# EAGLE design Mainsnode (EAGLE 6.2)
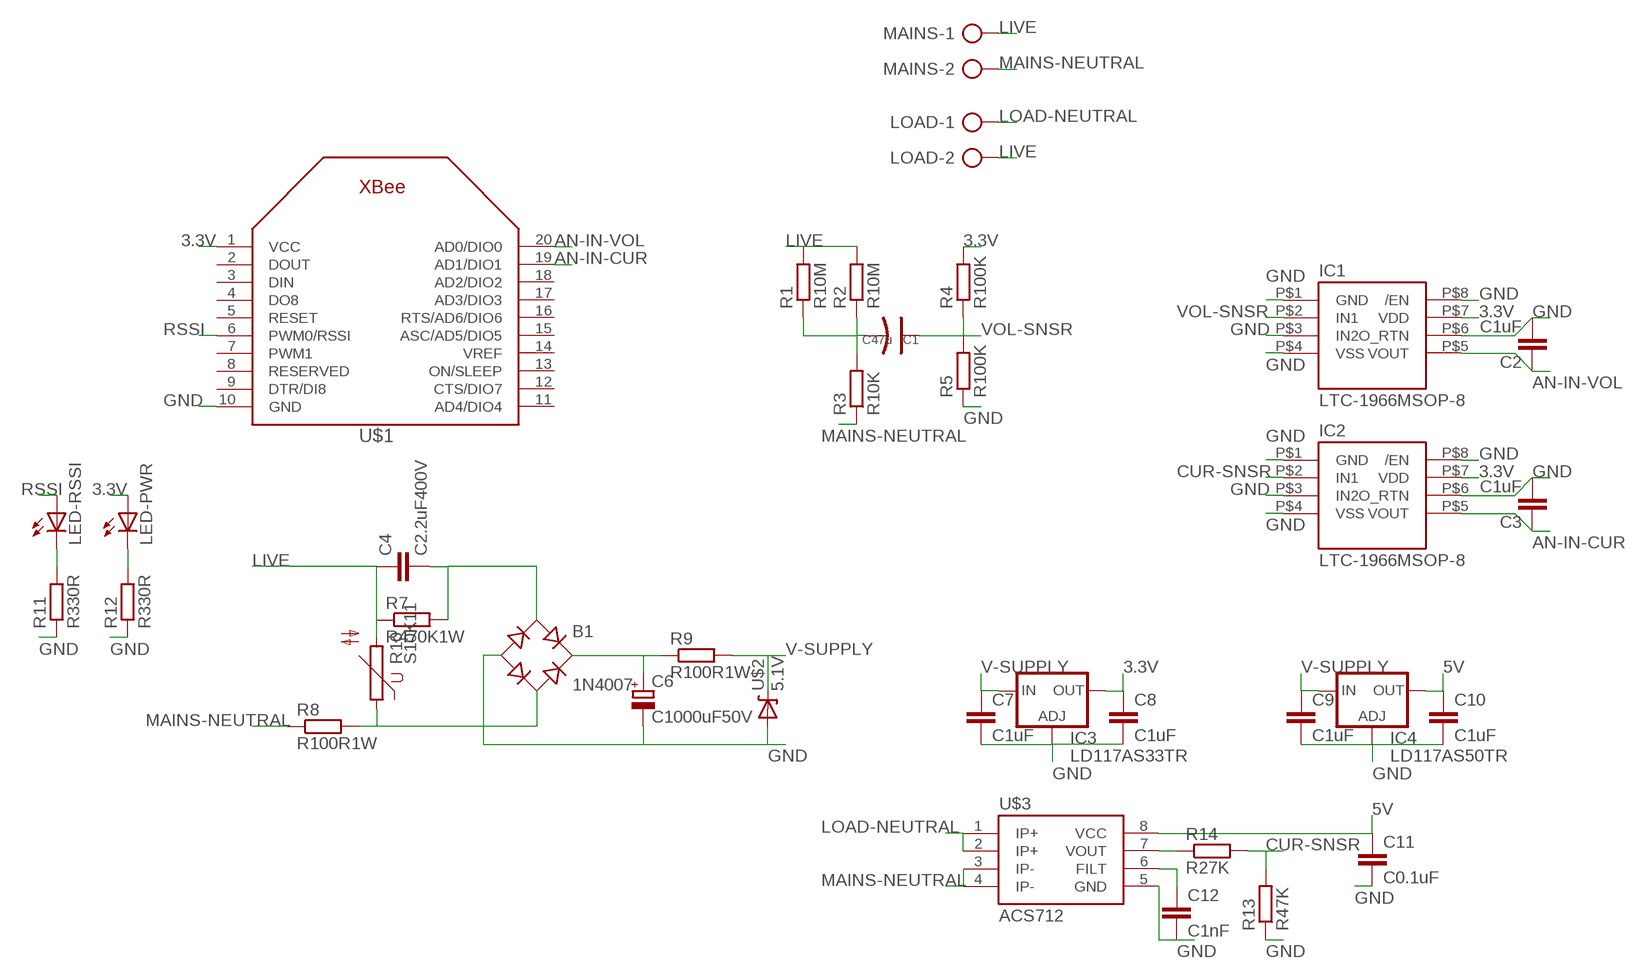
[diagram p0: schematic, sheet 1]

## Parts
B1  1N4007  RB1A  [RB1A]
C1  C47u  C-POLAR-C  [AVX-C]
C2  C1uF  C-EUC0805  [C0805]
C3  C1uF  C-EUC0805  [C0805]
C4  C2.2uF400V  C-EU150-064X183  [C150-064X183]
C6  C1000uF50V  CPOL-EUE2-5  [E2-5]
C7  C1uF  C-EUC0805  [C0805]
C8  C1uF  C-EUC0805  [C0805]
C9  C1uF  C-EUC0805  [C0805]
C10  C1uF  C-EUC0805  [C0805]
C11  C0.1uF  C-EUC0805  [C0805]
C12  C1nF  C-EUC0805  [C0805]
IC1  LTC-1966MSOP-8  [MSOP-8]
IC2  LTC-1966MSOP-8  [MSOP-8]
IC3  LD117AS33TR  [SOT223]
IC4  LD117AS50TR  [SOT223]
LED-PWR  LED0603  [LED-0603]
LED-RSSI  LED0603  [LED-0603]
LOAD  AK300/2  [AK300/2]
MAINS  AK300/2  [AK300/2]
R1  R10M  R-EU_0309/V  [0309V]
R2  R10M  R-EU_R0603  [R0603]
R3  R10K  R-EU_R0603  [R0603]
R4  R100K  R-EU_R0603  [R0603]
R5  R100K  R-EU_R0603  [R0603]
R7  R470K1W  R-EU_0309/V  [0309V]
R8  R100R1W  R-EU_0309/V  [0309V]
R9  R100R1W  R-EU_0309/V  [0309V]
R10  S10K11  [S10K11]
R11  R330R  R-EU_R0603  [R0603]
R12  R330R  R-EU_R0603  [R0603]
R13  R47K  R-EU_R0603  [R0603]
R14  R27K  R-EU_R0603  [R0603]
U$1  XBEE  [XBEE]
U$2  5.1V  DIODE-ZENERPTH  [DIODE-ZENER]
U$3  ACS712  [SO08]

## Nets
3.3V: C8.1 IC1.P$7(VDD) IC2.P$7(VDD) IC3.4(OUT) LED-PWR.A R4.2 U$1.1(VCC)
5V: C10.1 C11.1 IC4.4(OUT) U$3.8(VCC)
AN-IN-CUR: C3.1 IC2.P$5(VOUT) U$1.19(AD1/DIO1)
AN-IN-VOL: C2.1 IC1.P$5(VOUT) U$1.20(AD0/DIO0)
CUR-SNSR: IC2.P$2(IN1) R13.2 R14.2
GND: B1.- C2.2 C3.2 C6.- C7.2 C8.2 C9.2 C10.2 C11.2 C12.2 IC1.P$1(GND) IC1.P$3(IN2) IC1.P$4(VSS) IC1.P$6(O_RTN) IC1.P$8(/EN) IC2.P$1(GND) IC2.P$3(IN2) IC2.P$4(VSS) IC2.P$6(O_RTN) IC2.P$8(/EN) IC3.1(ADJ) IC4.1(ADJ) R5.1 R11.1 R12.1 R13.1 U$1.10(GND) U$2.P$2(A) U$3.5(GND)
LIVE: C4.1 LOAD.2 MAINS.1 R1.2 R2.2 R7.1 R10.2
LOAD-NEUTRAL: LOAD.1 U$3.1(IP+) U$3.2(IP+)
MAINS-NEUTRAL: MAINS.2 R3.1 R8.1 U$3.3(IP-) U$3.4(IP-)
N$1: C1.- R1.1 R2.1 R3.2
N$3: B1.+ C6.+ R9.1
N$4: LED-RSSI.C R11.2
N$5: B1.AC1 C4.2 R7.2
N$6: B1.AC2 R8.2 R10.1
N$7: C12.1 U$3.6(FILT)
N$8: LED-PWR.C R12.2
N$9: R14.1 U$3.7(VOUT)
RSSI: LED-RSSI.A U$1.6(PWM0/RSSI)
V-SUPPLY: C7.1 C9.1 IC3.3(IN) IC4.3(IN) R9.2 U$2.P$1(C)
VOL-SNSR: C1.+ IC1.P$2(IN1) R4.1 R5.2
Unconnected: U$1.2(DOUT) U$1.3(DIN) U$1.4(DO8) U$1.5(RESET) U$1.7(PWM1) U$1.8(RESERVED) U$1.9(DTR/DI8) U$1.11(AD4/DIO4) U$1.12(CTS/DIO7) U$1.13(ON/SLEEP) U$1.14(VREF) U$1.15(ASC/AD5/DIO5) U$1.16(RTS/AD6/DIO6) U$1.17(AD3/DIO3) U$1.18(AD2/DIO2)

## Library data of the parts
B1 = rectifier:RB1A: RECTIFIER 1 A
C1 = OPL Eagle Library:C-POLAR*
C2-C4 C7-C12 = resistor:C-EU: CAPACITOR, European symbol
C6 = resistor:CPOL-EU: POLARIZED CAPACITOR, European symbol
IC1 IC2 = custom-tigor:LTC-1966
IC3 IC4 = v-reg:LD117A?*: Low drop fixed and adjustable positive voltage regulators 1 A Source: http://www.st.com/stonline/products/literature/ds/7194/ld1117axx.pdf
LED-PWR LED-RSSI = SparkFun-LED:LED: LEDs Standard schematic elements and footprints for 5mm, 3mm, 1206, and 0603 sized LEDs. 5mm - Spark Fun Electronics SKU : COM-00529 (and others)
LOAD MAINS = con-ptr500:AK300/2: CONNECTOR; OC_FARNELL: unknown; OC_NEWARK: unknown
R1-R5 R7-R9 R11-R14 = resistor:R-EU_: RESISTOR, European symbol
R10 = varistor:S10K11: VARISTOR
U$1 = adafruit:XBEE
U$2 = SparkFun-DiscreteSemi:DIODE-ZENER: Zener Diode Production Part - 8199 3.4V Zener Voltage
U$3 = SparkFun-AnalogIC:ACS712: Hall-effect-based isolated linear current sensor

## Board
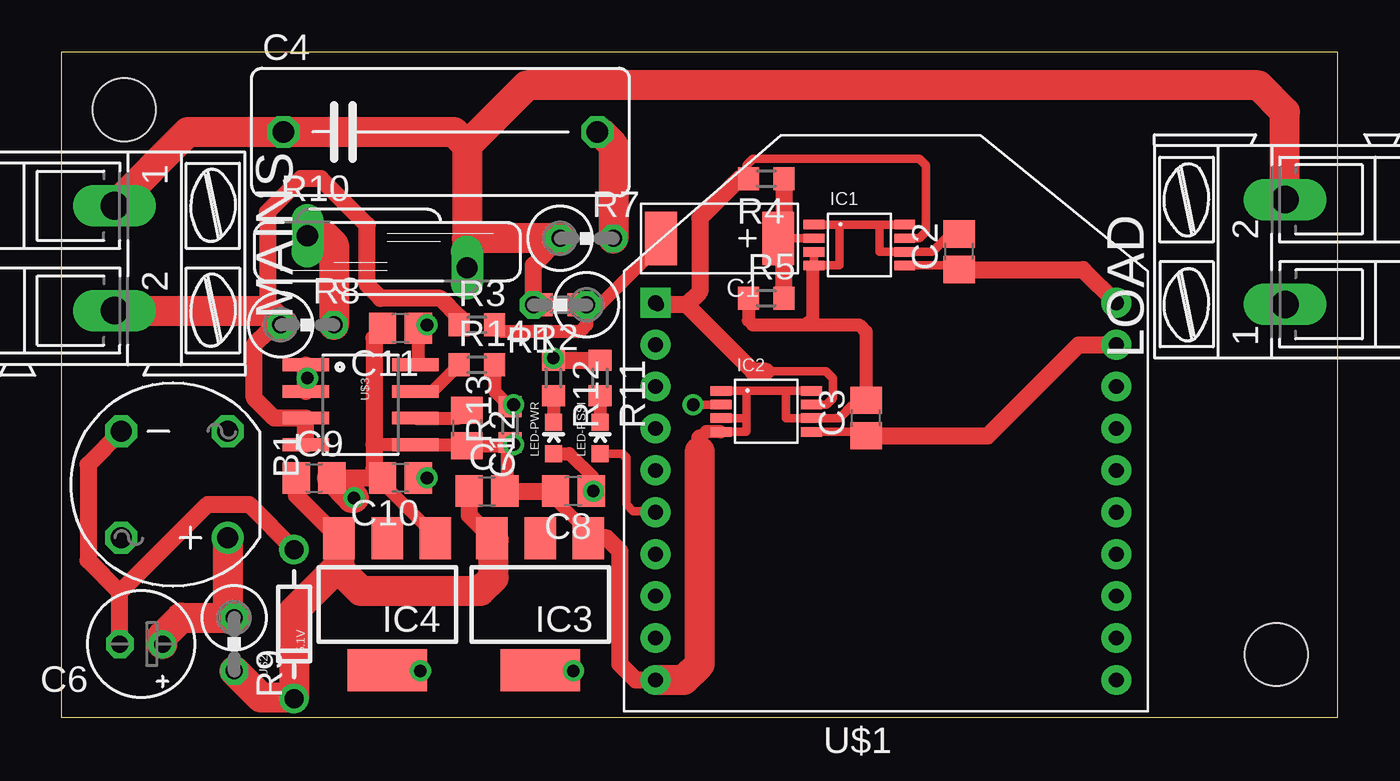
[diagram p1: board, top side]
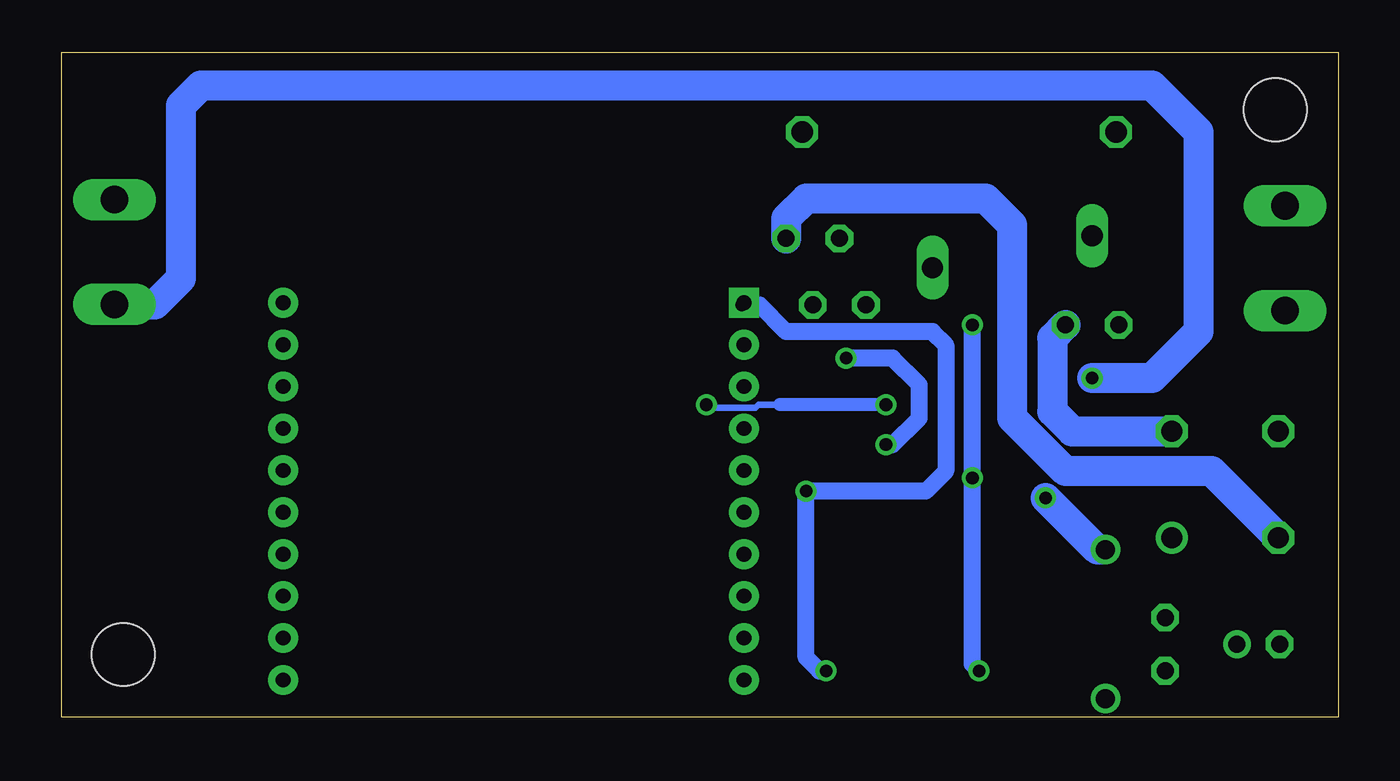
[diagram p2: board, bottom side, seen from below]

Size 60.95 x 31.74 mm. Coordinates in mm from the lower left corner, seen from the top.
Outline: 0,0 60.95,0 60.95,31.74 0,31.74 0,0
Copper layers (1*16): Top 0.035mm / dielectric 1.5mm / Bottom 0.035mm
Design rules: minimum track width 10mil, minimum drill 24mil, track to track 8mil, track to pad 8mil, pad to pad 8mil, via to via 8mil, smd to smd 8mil, copper to edge 40mil, drill to drill 8mil, minimum pad ring 10mil, minimum via ring 8mil, stop-mask expansion 4mil, vias tented up to drill 0mil, thermal gap 10mil
Holes 3 mm at 3,29 58,3

### Footprints (pad centres in the part's own frame; a part is rotated, then mirrored left to right if it is on the bottom)
RB1A = drill 1.016: + -2.54,2.54 | drill 1.016 octagon: - 2.54,-2.54; AC1 2.54,2.54; AC2 -2.54,-2.54
AVX-C = smd 1.524 x 2.54: + -2.794,0; - 2.794,0
C0805 = smd 1.3 x 1.5: 1 -0.85,0; 2 0.85,0
C150-064X183 = drill 1.016 octagon: 1 -7.493,0; 2 7.493,0
E2-5 = drill 0.813 pad 1.27: + -1.016,0 | drill 0.813 pad 1.27 octagon: - 1.016,0
MSOP-8 = smd 0.45 x 1: P$1 -0.975,-2.165; P$2 -0.325,-2.165; P$3 0.325,-2.165; P$4 0.975,-2.165; P$5 0.975,2.165; P$6 0.325,2.165; P$7 -0.325,2.165; P$8 -0.975,2.165
SOT223 = smd 1.5 x 2: 1 -2.3,-3.15; 2 0,-3.15; 3 2.3,-3.15 | smd 3.8 x 2: 4 0,3.15
LED-0603 = smd 0.8 x 0.8: A 0,-0.75; C 0,0.75
AK300/2 = drill 1.321 long: 1 -2.515,0; 2 2.489,0
0309V = drill 0.813 octagon: 1 -1.27,0; 2 1.27,0
R0603 = smd 1 x 1.1: 1 -0.85,0; 2 0.85,0
S10K11 = drill 1.016 long: 1 -0.762,-3.81; 2 0.762,3.81
XBEE = drill 0.7 pad 1.422 square: 1 -11,5.5 | drill 0.7 pad 1.422: 2 -11,3.5; 3 -11,1.5; 4 -11,-0.5; 5 -11,-2.5; 6 -11,-4.5; 7 -11,-6.5; 8 -11,-8.5; 9 -11,-10.5; 10 -11,-12.5; 11 11,-12.5; 12 11,-10.5; 13 11,-8.5; 14 11,-6.5; 15 11,-4.5; 16 11,-2.5; 17 11,-0.5; 18 11,1.5; 19 11,3.5; 20 11,5.5
DIODE-ZENER = drill 0.9: P$1 -3.556,0; P$2 3.556,0
SO08 = smd 0.61 x 2.21: 1 -1.905,-2.616; 2 -0.635,-2.616; 3 0.635,-2.616; 4 1.905,-2.616; 5 1.905,2.616; 6 0.635,2.616; 7 -0.635,2.616; 8 -1.905,2.616

### Placement (x,y rotation side)
B1  5.4,11.11 180 top
C1  31.43,22.86 180 top
C2  42.86,22.23 90 top
C3  38.42,14.29 90 top
C4  18.1,27.94 0 top
C6  3.81,3.49 180 top
C7  20.32,10.79 0 top
C8  24.45,10.79 180 top
C9  12.06,11.43 0 top
C10  16.19,11.43 180 top
C11  16.19,18.57 180 top
C12  19.37,13.81 270 top
IC1  38.1,22.54 270 top
IC2  33.66,14.61 270 top
IC3  22.86,5.4 180 top
IC4  15.56,5.4 180 top
LED-PWR  23.5,13.34 0 top
LED-RSSI  25.72,13.34 0 top
LOAD  58.42,22.23 90 top
MAINS  2.54,21.91 270 top
R1  23.81,19.68 180 top
R2  23.81,19.68 180 top
R3  19.84,18.73 0 top
R4  33.66,25.72 180 top
R5  33.66,20 0 top
R7  25.08,22.86 0 top
R8  11.75,18.73 0 top
R9  8.26,3.49 270 top
R10  15.56,22.23 270 top
R11  25.72,16.19 270 top
R12  23.5,16.19 270 top
R13  21.43,13.97 90 top
R14  19.84,16.83 0 top
U$1  39.37,14.29 0 top
U$2  11.11,4.45 90 top
U$3  14.29,14.92 270 top

### Tracks (layer width: path | path; a pad name or v marks a point on that pad's centre or on a via)
3.3V  (via drill 0.6)
  Top 0.406: IC1.P$7 40.97,22.87 41.27,23.18 41.27,26.35 40.96,26.67 33.02,26.67 32.7,26.35 32.7,25.82 R4.2 | IC2.P$7 36.52,14.93 36.83,15.24 36.83,16.19 36.51,16.51 33.66,16.51
  Top 0.61: LED-PWR.A 24.25,12.59 25.4,11.43 25.4,10.9 C8.1
  Top 0.813: R4.2 32.38,25.72 30.48,23.81 30.48,20.32 29.84,19.68 | 29.84,19.68 v28.47,19.68 U$1.1 | 33.66,16.51 33.02,16.51 29.84,19.68 | v24.45,2.22 22.89,2.22 IC3.4 | 25.4,10.9 v25.4,10.79
  Bottom 0.813: v24.45,2.22 24.77,2.22 25.4,2.86 v25.4,10.79 19.68,10.79 18.73,11.75 18.73,17.78 19.37,18.41 26.35,18.41 27.62,19.68 v28.47,19.68
5V  (via drill 0.6)
  Top 0.61: C11.1 17.04,16.97 U$3.8
  Top 0.813: v17.14,2.22 15.58,2.22 IC4.4 | v17.46,11.43 C10.1 | v17.46,18.73 17.2,18.73 C11.1
  Bottom 0.813: v17.14,2.22 17.46,2.54 v17.46,11.43 v17.46,18.73
AN-IN-CUR
  Top 0.406: IC2.P$5 38.23,13.63 C3.1
  Top 0.813: C3.1 44.23,13.44 48.58,17.78 U$1.19
AN-IN-VOL
  Top 0.406: IC1.P$5 42.67,21.57 C2.1
  Top 0.813: C2.1 48.78,21.38 U$1.20
CUR-SNSR  (via drill 0.6)
  Top 0.406: IC2.P$2 v30.17,14.93 v30.16,14.92
  Top 0.61: R14.2 20.69,15.56 R13.2 21.49,14.82 v21.59,14.92
  Bottom 0.305: 26.67,14.92 27.68,14.92 27.8,14.8 27.81,14.79 30.02,14.79 v30.16,14.92
  Bottom 0.61: v21.59,14.92 26.67,14.92
GND  (via drill 0.6)
  Top 0.406: C3.2 38.2,14.92 37.78,14.92 37.14,14.28 IC2.P$6 34.62,14.28 34.61,14.29 34.61,15.58 | IC2.P$8 34.61,15.58 | 34.61,15.58 32.7,15.58 | 32.7,15.58 IC2.P$1 | IC2.P$3 32.38,14.28 32.38,14.29 32.7,14.29 | 32.7,14.29 32.7,15.58 | IC2.P$4 32.68,13.63 32.7,13.65 32.7,14.29 | IC1.P$3 IC1.P$4 35.96,21.59 37.15,21.59 37.15,23.5 | IC1.P$1 37.12,23.52 37.15,23.5 | IC1.P$8 39.05,23.52 | 39.05,23.52 37.17,23.52 37.15,23.5 | 39.05,23.52 39.05,22.23 39.06,22.22 IC1.P$6 41.59,22.23 42.44,23.07 C2.2
  Top 0.61: 21.27,12.96 C12.2 19.31,13.02 U$3.5 14.92,13.02 | 21.27,12.96 R13.1 | R5.1 32.8,18.95 33.02,18.73 35.56,18.73 | 35.56,18.73 35.88,19.05 35.88,21.51 IC1.P$4 | C10.2 15.34,11.17 17.46,9.05 17.46,8.94 IC4.1 | C8.2 23.6,10.38 24.77,9.21 24.77,8.94 IC3.1 | 21.27,12.96 21.27,10.9 C7.2 | 30.48,13.34 30.8,13.65 31.47,13.65 IC2.P$4 | 35.56,18.73 38.1,18.73 38.42,18.41 C3.2
  Top 0.813: R11.1 R12.1 v23.5,17.14 | C6.- 2.79,5.97 | 2.79,5.97 6.99,10.16 8.95,10.16 U$2.P$2 | B1.- 1.27,12.06 1.27,7.49 2.79,5.97 | C9.2 C10.2 14.92,11.85 14.92,13.02 14.92,18.1 15.34,18.52 C11.2 | C7.2 C8.2 | IC3.1 25.18,8.57 26.04,8.57 26.67,7.94 26.67,2.54 27.42,1.79 U$1.10 | v21.59,13.02 21.53,13.02 R13.1 | 30.48,12.7 30.48,13.34
  Top 1.422: U$1.10 29.73,1.79 30.48,2.54 30.48,12.7 | v13.97,10.48 13.87,10.48 C9.2
  Bottom 0.813: v21.59,13.02 21.27,13.02 20,14.29 20,15.88 21.27,17.14 v23.5,17.14
  Bottom 1.422: U$2.P$2 11.49,8 v13.97,10.48
LIVE
  Top 0.813: R7.1 22.54,21.59 R1.2 R2.2
  Top 1.422: MAINS.1 2.54,24.45 6.03,27.94 C4.1 18.73,27.94 19.37,27.3 | 19.37,27.3 19.37,22.86 | 19.37,22.86 R10.2 | R7.1 19.37,22.86 | LOAD.2 58.42,28.89 57.15,30.16 22.23,30.16 19.37,27.3
LOAD-NEUTRAL  (via drill 0.6)
  Top 0.813: U$3.1 U$3.2 11.75,15.63 v11.75,16.19
  Bottom 1.422: LOAD.1 56.49,19.71 55.24,20.95 55.24,29.21 54.29,30.16 8.89,30.16 6.67,27.94 6.67,18.41 8.89,16.19 v11.75,16.19
MAINS-NEUTRAL
  Top 0.813: U$3.4 U$3.3 10.16,14.29 9.21,15.24 9.21,17.78 9.84,18.41 10.16,18.41 R8.1 | R3.1 18.99,19.11 18.1,20 15.24,20 14.61,20.64 14.61,23.5 12.38,25.72 11.43,25.72 9.84,24.13 9.84,19.47 9.79,19.42
  Top 1.422: MAINS.2 9.79,19.42 R8.1
N$1
  Top 0.61: R1.1 25.08,18.73 24.77,18.41 21.01,18.41 R3.2 | R1.1 R2.1 | C1.- 28.64,22.61 25.72,19.68 R1.1
N$3
  Top 1.422: C6.+ 4.83,3.87 5.71,4.76 R9.1 7.94,5.08 B1.+
N$4
  Top 0.61: R11.2 LED-RSSI.C
N$5
  Top 1.422: C4.2 25.72,27.94 26.35,27.3 R7.2
  Bottom 1.422: B1.AC1 6.03,11.75 13.02,11.75 15.56,14.29 15.56,23.5 16.83,24.77 25.4,24.77 26.35,23.81 R7.2
N$6
  Top 1.422: R10.1 12.57,22.99 13.02,22.54 R8.2
  Bottom 1.422: R8.2 13.65,18.1 13.65,14.61 12.7,13.65 B1.AC2
N$7
  Top 0.61: U$3.6 18.99,14.29 C12.1
N$8
  Top 0.61: R12.2 LED-PWR.C
N$9
  Top 0.61: U$3.7 17.72,15.56 R14.1
RSSI
  Top 0.406: LED-RSSI.A 26.79,12.59 26.99,12.38 26.99,10.16 27.3,9.84 28.32,9.84 U$1.6
V-SUPPLY
  Top 0.813: C9.1 11.21,10.59 IC4.3 | C7.1 19.47,9.64 IC3.3
  Top 1.422: R9.2 9.53,0.95 11.05,0.95 U$2.P$1 11.11,5.08 13.26,7.22 IC4.3 13.26,7.06 14.29,6.03 20,6.03 20.64,6.67 20.64,8.47 IC3.3
VOL-SNSR
  Top 0.406: IC1.P$2 C1.+
  Top 0.813: R4.1 34.51,23.14 C1.+ 34.51,22.58 R5.2